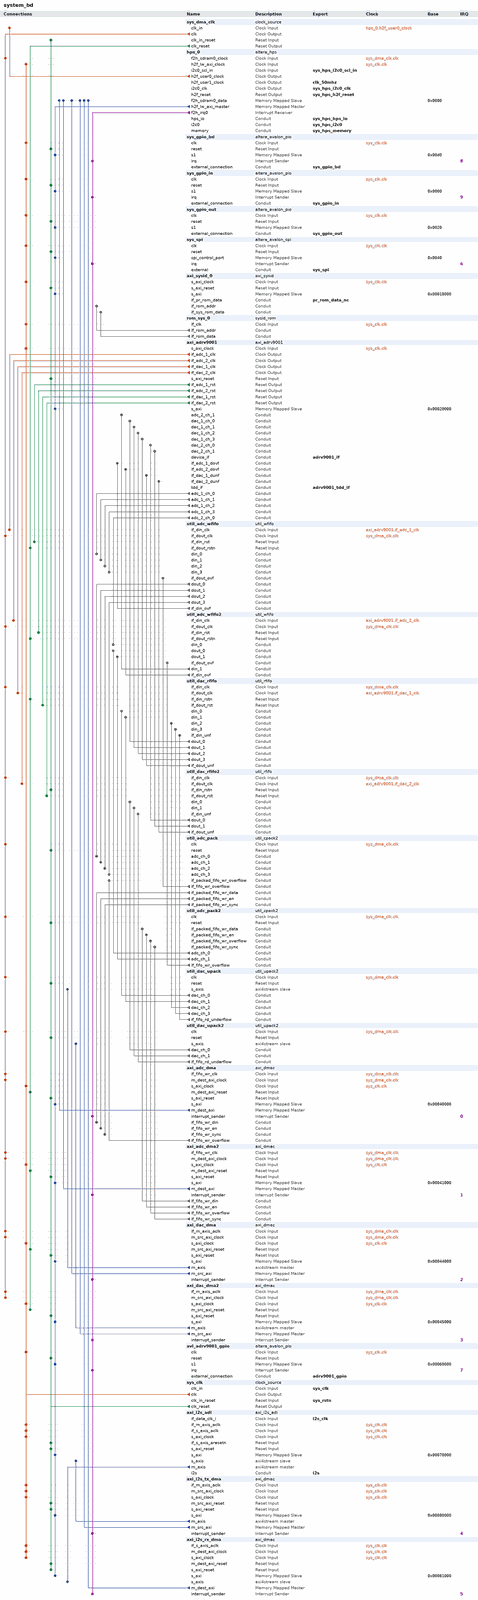
[diagram p0: system contents, whole]
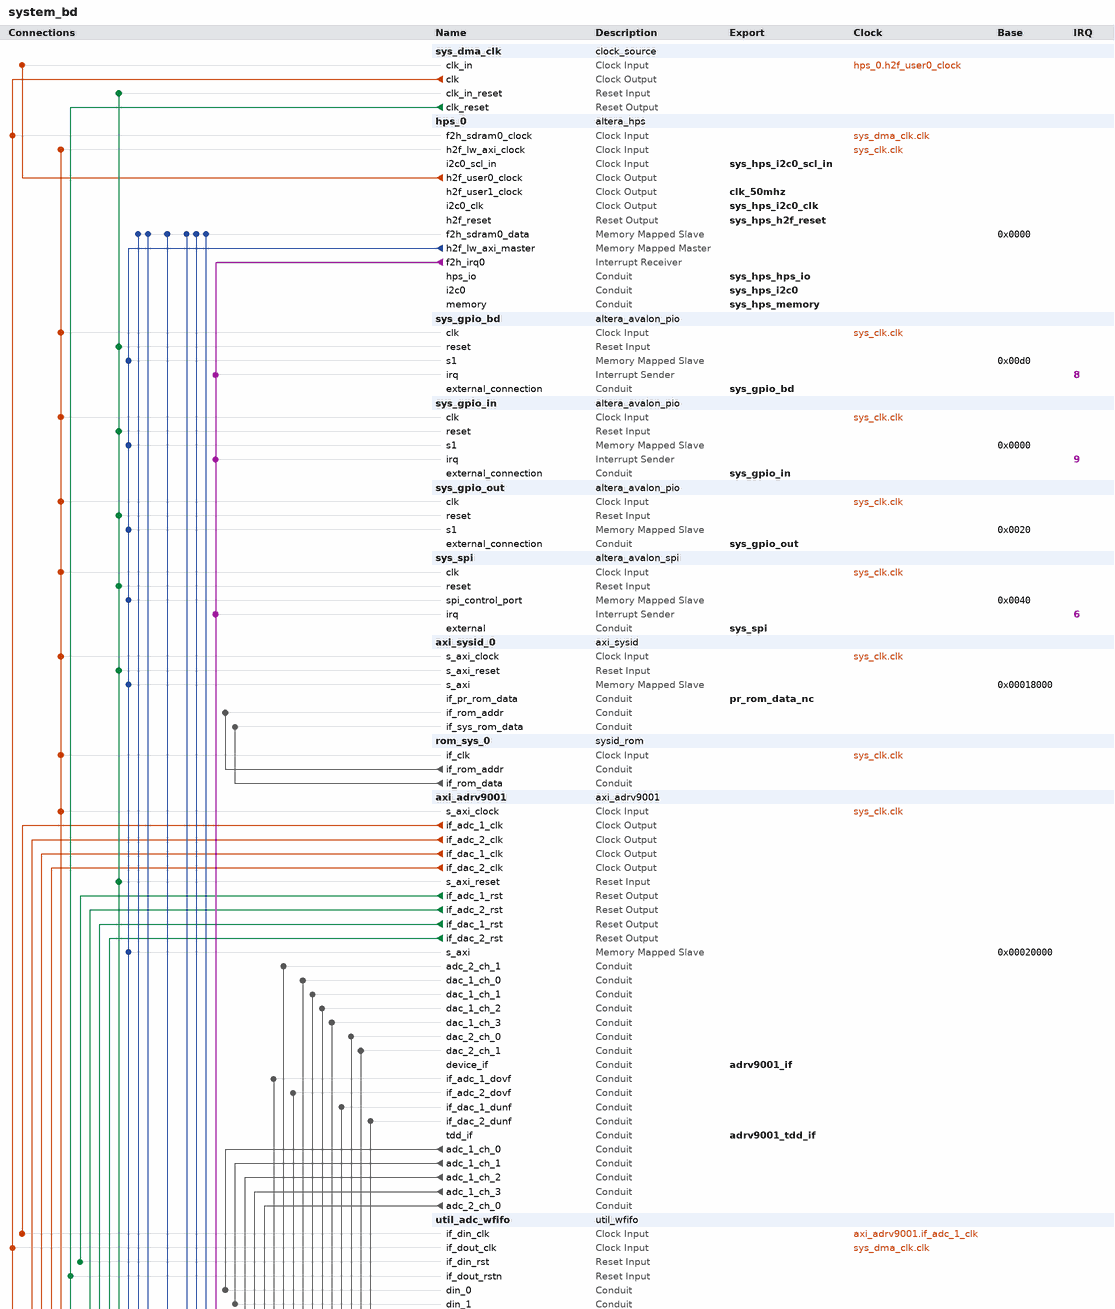
[diagram p1: system contents, upper part]
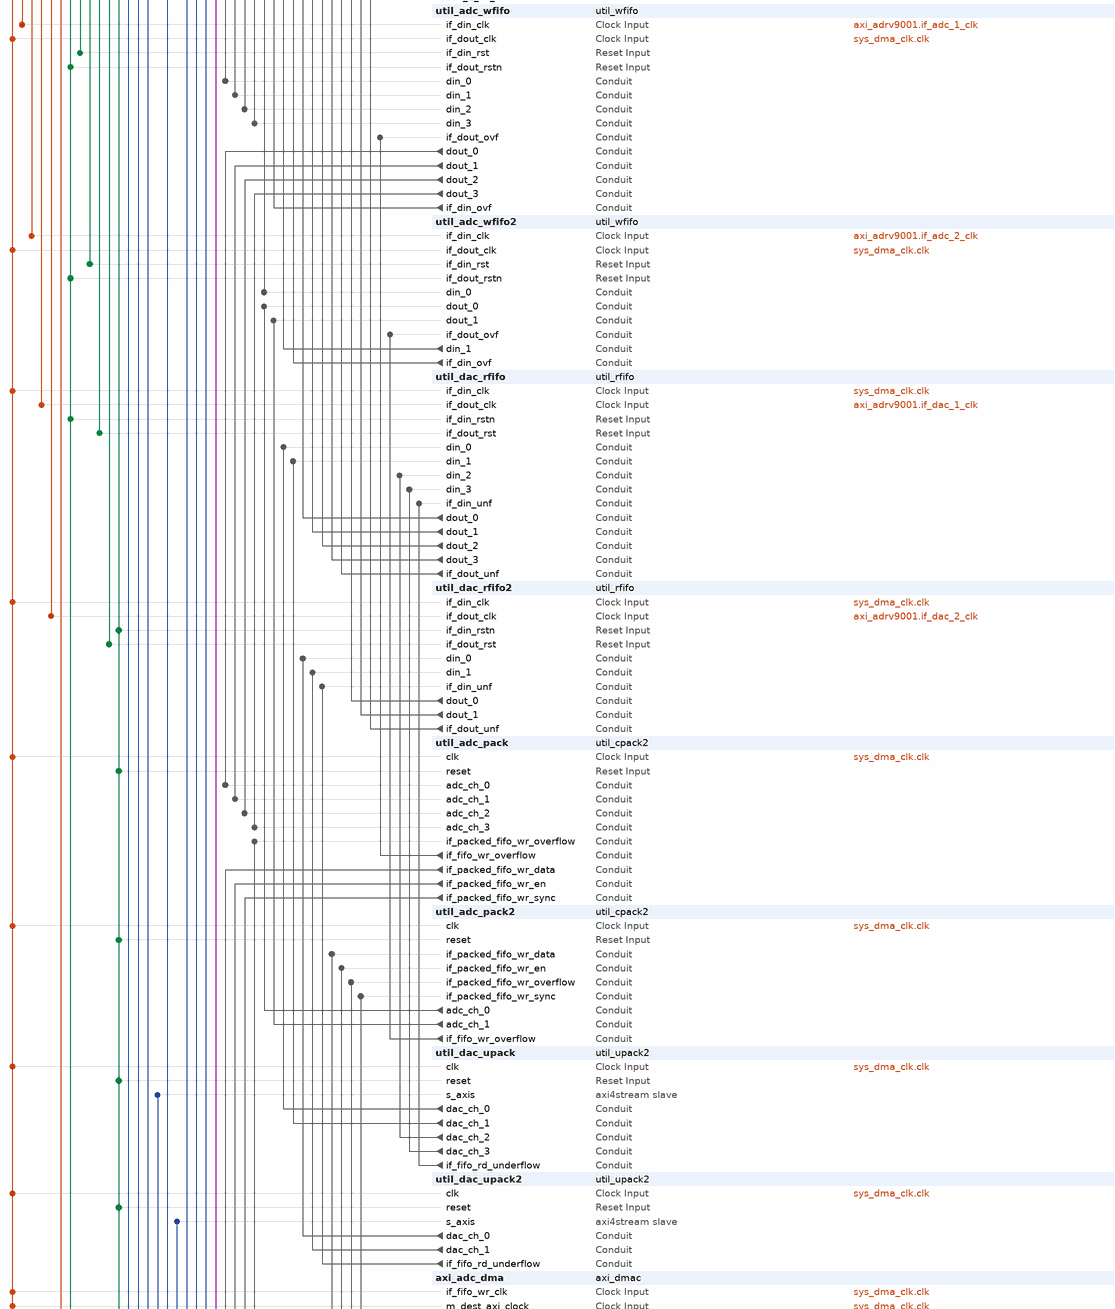
[diagram p2: system contents, middle part]
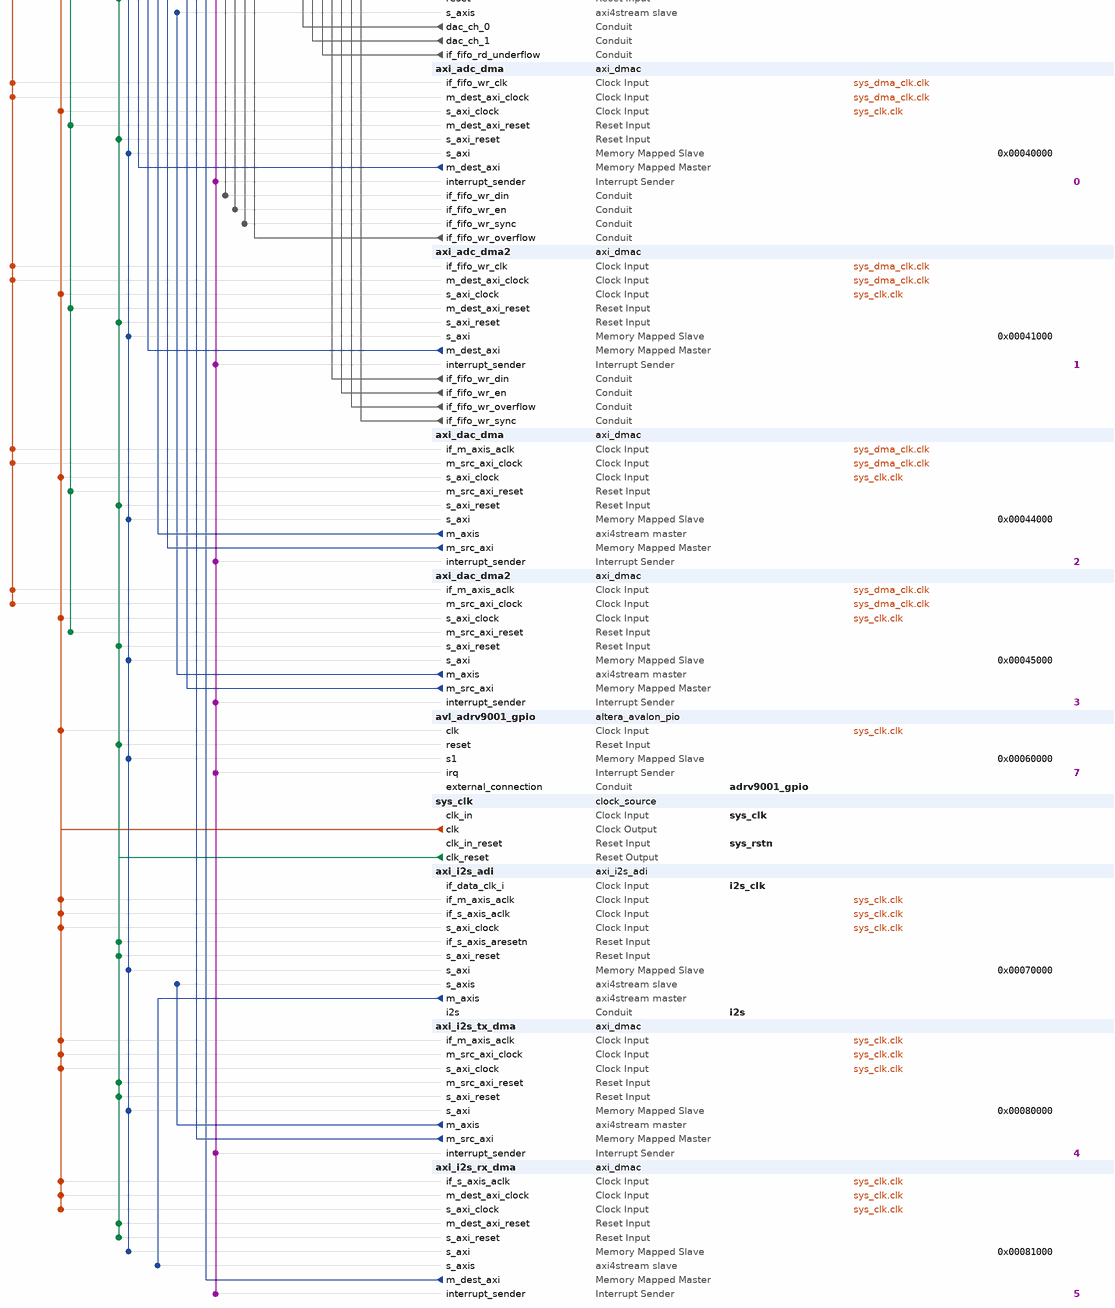
[diagram p3: system contents, lower part]
# Platform Designer (Qsys) system system_bd, Cyclone V 5CSEBA6U23C7
# Parameters at their usual value, and those the tool derives, are not listed.
package require -exact qsys 20.1
create_system system_bd
set_project_property DEVICE_FAMILY {Cyclone V}
set_project_property DEVICE 5CSEBA6U23C7

add_instance sys_dma_clk clock_source 20.1
set_instance_parameter_value sys_dma_clk clockFrequency 80000000

add_instance hps_0 altera_hps 20.1
set_instance_parameter_value hps_0 EMAC1_Mode N/A
set_instance_parameter_value hps_0 EMAC1_PinMuxing Unused
set_instance_parameter_value hps_0 F2SCLK_COLDRST_Enable false
set_instance_parameter_value hps_0 F2SCLK_DBGRST_Enable false
set_instance_parameter_value hps_0 F2SCLK_WARMRST_Enable false
set_instance_parameter_value hps_0 F2SDRAM_Type AXI-3
set_instance_parameter_value hps_0 F2SDRAM_Width 128
set_instance_parameter_value hps_0 F2SINTERRUPT_Enable true
set_instance_parameter_value hps_0 F2S_Width 0
set_instance_parameter_value hps_0 FPGA_PERIPHERAL_OUTPUT_CLOCK_FREQ_EMAC0_GTX_CLK 125
set_instance_parameter_value hps_0 FPGA_PERIPHERAL_OUTPUT_CLOCK_FREQ_EMAC0_MD_CLK 2.5
set_instance_parameter_value hps_0 FPGA_PERIPHERAL_OUTPUT_CLOCK_FREQ_EMAC1_GTX_CLK 125
set_instance_parameter_value hps_0 FPGA_PERIPHERAL_OUTPUT_CLOCK_FREQ_EMAC1_MD_CLK 2.5
set_instance_parameter_value hps_0 HPS_PROTOCOL DDR3
set_instance_parameter_value hps_0 I2C0_Mode Full
set_instance_parameter_value hps_0 I2C0_PinMuxing FPGA
set_instance_parameter_value hps_0 I2C1_Mode N/A
set_instance_parameter_value hps_0 I2C1_PinMuxing Unused
set_instance_parameter_value hps_0 LWH2F_Enable true
set_instance_parameter_value hps_0 MEM_BANKADDR_WIDTH 3
set_instance_parameter_value hps_0 MEM_CLK_FREQ 333.3
set_instance_parameter_value hps_0 MEM_COL_ADDR_WIDTH 10
set_instance_parameter_value hps_0 MEM_DQ_WIDTH 32
set_instance_parameter_value hps_0 MEM_DRV_STR RZQ/6
set_instance_parameter_value hps_0 MEM_ROW_ADDR_WIDTH 15
set_instance_parameter_value hps_0 MEM_RTT_NOM RZQ/4
set_instance_parameter_value hps_0 MEM_RTT_WR {Dynamic ODT off}
set_instance_parameter_value hps_0 MEM_TCL 7
set_instance_parameter_value hps_0 MEM_TFAW_NS 37.5
set_instance_parameter_value hps_0 MEM_TRAS_NS 35.0
set_instance_parameter_value hps_0 MEM_TRCD_NS 13.75
set_instance_parameter_value hps_0 MEM_TRFC_NS 300.0
set_instance_parameter_value hps_0 MEM_TRP_NS 13.75
set_instance_parameter_value hps_0 MEM_VENDOR Other
set_instance_parameter_value hps_0 MEM_WTCL 7
set_instance_parameter_value hps_0 QSPI_Mode {1 SS}
set_instance_parameter_value hps_0 QSPI_PinMuxing {HPS I/O Set 0}
set_instance_parameter_value hps_0 REF_CLK_FREQ 25.0
set_instance_parameter_value hps_0 S2FCLK_USER0CLK_Enable true
set_instance_parameter_value hps_0 S2FCLK_USER1CLK_Enable true
set_instance_parameter_value hps_0 S2FCLK_USER1CLK_FREQ 50.0
set_instance_parameter_value hps_0 S2FCLK_USER2CLK 3
set_instance_parameter_value hps_0 S2F_Width 0
set_instance_parameter_value hps_0 SDIO_Mode {4-bit Data}
set_instance_parameter_value hps_0 SDIO_PinMuxing {HPS I/O Set 0}
set_instance_parameter_value hps_0 SPIM1_Mode N/A
set_instance_parameter_value hps_0 SPIM1_PinMuxing Unused
set_instance_parameter_value hps_0 STM_Enable false
set_instance_parameter_value hps_0 TIMING_BOARD_AC_SKEW 0.02
set_instance_parameter_value hps_0 TIMING_BOARD_AC_TO_CK_SKEW 0.0
set_instance_parameter_value hps_0 TIMING_BOARD_DQ_TO_DQS_SKEW 0.0
set_instance_parameter_value hps_0 TIMING_BOARD_MAX_CK_DELAY 0.6
set_instance_parameter_value hps_0 TIMING_BOARD_MAX_DQS_DELAY 0.6
set_instance_parameter_value hps_0 TIMING_BOARD_SKEW_BETWEEN_DQS 0.02
set_instance_parameter_value hps_0 TIMING_BOARD_SKEW_CKDQS_DIMM_MAX 0.01
set_instance_parameter_value hps_0 TIMING_BOARD_SKEW_CKDQS_DIMM_MIN -0.01
set_instance_parameter_value hps_0 TIMING_BOARD_SKEW_WITHIN_DQS 0.02
set_instance_parameter_value hps_0 TIMING_TDH 125
set_instance_parameter_value hps_0 TIMING_TDQSCK 400
set_instance_parameter_value hps_0 TIMING_TDQSQ 120
set_instance_parameter_value hps_0 TIMING_TDS 50
set_instance_parameter_value hps_0 TIMING_TIH 250
set_instance_parameter_value hps_0 TIMING_TIS 175
set_instance_parameter_value hps_0 TIMING_TQSH 0.38
set_instance_parameter_value hps_0 UART0_Mode {No Flow Control}
set_instance_parameter_value hps_0 UART0_PinMuxing {HPS I/O Set 1}
set_instance_parameter_value hps_0 USB1_Mode SDR
set_instance_parameter_value hps_0 USB1_PinMuxing {HPS I/O Set 0}
set_instance_parameter_value hps_0 desired_cfg_clk_mhz 80.0
set_instance_parameter_value hps_0 desired_qspi_clk_mhz 400.0

add_instance sys_gpio_bd altera_avalon_pio 20.1
set_instance_parameter_value sys_gpio_bd direction InOut
set_instance_parameter_value sys_gpio_bd generateIRQ true
set_instance_parameter_value sys_gpio_bd width 32

add_instance sys_gpio_in altera_avalon_pio 20.1
set_instance_parameter_value sys_gpio_in direction Input
set_instance_parameter_value sys_gpio_in generateIRQ true
set_instance_parameter_value sys_gpio_in width 32

add_instance sys_gpio_out altera_avalon_pio 20.1
set_instance_parameter_value sys_gpio_out direction Output
set_instance_parameter_value sys_gpio_out width 32

add_instance sys_spi altera_avalon_spi 20.1
set_instance_parameter_value sys_spi clockPolarity 0
set_instance_parameter_value sys_spi dataWidth 8
set_instance_parameter_value sys_spi masterSPI true
set_instance_parameter_value sys_spi numberOfSlaves 1
set_instance_parameter_value sys_spi targetClockRate 10000000

add_instance axi_sysid_0 axi_sysid 1.0
set_instance_parameter_value axi_sysid_0 ROM_ADDR_BITS 9
set_instance_parameter_value axi_sysid_0 ROM_WIDTH 32

add_instance rom_sys_0 sysid_rom 1.0
set_instance_parameter_value rom_sys_0 PATH_TO_FILE mem_init_sys.txt
set_instance_parameter_value rom_sys_0 ROM_ADDR_BITS 9
set_instance_parameter_value rom_sys_0 ROM_WIDTH 32

add_instance axi_adrv9001 axi_adrv9001 1.0
set_instance_parameter_value axi_adrv9001 CMOS_LVDS_N 0
set_instance_parameter_value axi_adrv9001 DDS_DISABLE 0
set_instance_parameter_value axi_adrv9001 DEVICE 5CSEBA6U23C7
set_instance_parameter_value axi_adrv9001 DEV_PACKAGE_MANUAL 0
set_instance_parameter_value axi_adrv9001 FPGA_FAMILY_MANUAL 0
set_instance_parameter_value axi_adrv9001 FPGA_TECHNOLOGY_MANUAL 100
set_instance_parameter_value axi_adrv9001 ID 0
set_instance_parameter_value axi_adrv9001 IO_DELAY_GROUP dev_if_delay_group
set_instance_parameter_value axi_adrv9001 SPEED_GRADE_MANUAL 0

add_instance util_adc_wfifo util_wfifo 1.0
set_instance_parameter_value util_adc_wfifo DIN_ADDRESS_WIDTH 5
set_instance_parameter_value util_adc_wfifo DIN_DATA_WIDTH 16
set_instance_parameter_value util_adc_wfifo DOUT_DATA_WIDTH 16
set_instance_parameter_value util_adc_wfifo NUM_OF_CHANNELS 4

add_instance util_adc_wfifo2 util_wfifo 1.0
set_instance_parameter_value util_adc_wfifo2 DIN_ADDRESS_WIDTH 5
set_instance_parameter_value util_adc_wfifo2 DIN_DATA_WIDTH 16
set_instance_parameter_value util_adc_wfifo2 DOUT_DATA_WIDTH 16
set_instance_parameter_value util_adc_wfifo2 NUM_OF_CHANNELS 2

add_instance util_dac_rfifo util_rfifo 1.0
set_instance_parameter_value util_dac_rfifo DIN_ADDRESS_WIDTH 5
set_instance_parameter_value util_dac_rfifo DIN_DATA_WIDTH 16
set_instance_parameter_value util_dac_rfifo DOUT_DATA_WIDTH 16
set_instance_parameter_value util_dac_rfifo NUM_OF_CHANNELS 4

add_instance util_dac_rfifo2 util_rfifo 1.0
set_instance_parameter_value util_dac_rfifo2 DIN_ADDRESS_WIDTH 5
set_instance_parameter_value util_dac_rfifo2 DIN_DATA_WIDTH 16
set_instance_parameter_value util_dac_rfifo2 DOUT_DATA_WIDTH 16
set_instance_parameter_value util_dac_rfifo2 NUM_OF_CHANNELS 2

add_instance util_adc_pack util_cpack2 1.0
set_instance_parameter_value util_adc_pack NUM_OF_CHANNELS 4
set_instance_parameter_value util_adc_pack SAMPLES_PER_CHANNEL 1
set_instance_parameter_value util_adc_pack SAMPLE_DATA_WIDTH 16

add_instance util_adc_pack2 util_cpack2 1.0
set_instance_parameter_value util_adc_pack2 NUM_OF_CHANNELS 2
set_instance_parameter_value util_adc_pack2 SAMPLES_PER_CHANNEL 1
set_instance_parameter_value util_adc_pack2 SAMPLE_DATA_WIDTH 16

add_instance util_dac_upack util_upack2 1.0
set_instance_parameter_value util_dac_upack INTERFACE_TYPE 0
set_instance_parameter_value util_dac_upack NUM_OF_CHANNELS 4
set_instance_parameter_value util_dac_upack SAMPLES_PER_CHANNEL 1
set_instance_parameter_value util_dac_upack SAMPLE_DATA_WIDTH 16

add_instance util_dac_upack2 util_upack2 1.0
set_instance_parameter_value util_dac_upack2 INTERFACE_TYPE 0
set_instance_parameter_value util_dac_upack2 NUM_OF_CHANNELS 2
set_instance_parameter_value util_dac_upack2 SAMPLES_PER_CHANNEL 1
set_instance_parameter_value util_dac_upack2 SAMPLE_DATA_WIDTH 16

add_instance axi_adc_dma axi_dmac 1.0
set_instance_parameter_value axi_adc_dma ASYNC_CLK_DEST_REQ_MANUAL 1
set_instance_parameter_value axi_adc_dma ASYNC_CLK_REQ_SRC_MANUAL 1
set_instance_parameter_value axi_adc_dma ASYNC_CLK_SRC_DEST_MANUAL 1
set_instance_parameter_value axi_adc_dma AXI_SLICE_DEST 0
set_instance_parameter_value axi_adc_dma AXI_SLICE_SRC 0
set_instance_parameter_value axi_adc_dma CLK_DOMAIN_DEST_AXI 16
set_instance_parameter_value axi_adc_dma CLK_DOMAIN_DEST_FIFO 0
set_instance_parameter_value axi_adc_dma CLK_DOMAIN_DEST_SAXI 0
set_instance_parameter_value axi_adc_dma CLK_DOMAIN_REQ 3
set_instance_parameter_value axi_adc_dma CLK_DOMAIN_SRC_AXI 0
set_instance_parameter_value axi_adc_dma CLK_DOMAIN_SRC_FIFO 16
set_instance_parameter_value axi_adc_dma CLK_DOMAIN_SRC_SAXI 0
set_instance_parameter_value axi_adc_dma CYCLIC 0
set_instance_parameter_value axi_adc_dma DISABLE_DEBUG_REGISTERS 0
set_instance_parameter_value axi_adc_dma DMA_2D_TRANSFER 0
set_instance_parameter_value axi_adc_dma DMA_AXIS_DEST_W 4
set_instance_parameter_value axi_adc_dma DMA_AXIS_ID_W 8
set_instance_parameter_value axi_adc_dma DMA_AXI_ADDR_WIDTH 32
set_instance_parameter_value axi_adc_dma DMA_AXI_PROTOCOL_DEST 1
set_instance_parameter_value axi_adc_dma DMA_AXI_PROTOCOL_SRC 1
set_instance_parameter_value axi_adc_dma DMA_DATA_WIDTH_DEST 64
set_instance_parameter_value axi_adc_dma DMA_DATA_WIDTH_SRC 64
set_instance_parameter_value axi_adc_dma DMA_LENGTH_WIDTH 24
set_instance_parameter_value axi_adc_dma DMA_TYPE_DEST 0
set_instance_parameter_value axi_adc_dma DMA_TYPE_SRC 2
set_instance_parameter_value axi_adc_dma ENABLE_DIAGNOSTICS_IF 0
set_instance_parameter_value axi_adc_dma FIFO_SIZE 4
set_instance_parameter_value axi_adc_dma HAS_AXIS_TDEST 0
set_instance_parameter_value axi_adc_dma HAS_AXIS_TID 0
set_instance_parameter_value axi_adc_dma HAS_AXIS_TKEEP 0
set_instance_parameter_value axi_adc_dma HAS_AXIS_TLAST 0
set_instance_parameter_value axi_adc_dma HAS_AXIS_TSTRB 0
set_instance_parameter_value axi_adc_dma HAS_AXIS_TUSER 0
set_instance_parameter_value axi_adc_dma ID 0
set_instance_parameter_value axi_adc_dma MAX_BYTES_PER_BURST 128
set_instance_parameter_value axi_adc_dma SYNC_TRANSFER_START 1

add_instance axi_adc_dma2 axi_dmac 1.0
set_instance_parameter_value axi_adc_dma2 ASYNC_CLK_DEST_REQ_MANUAL 1
set_instance_parameter_value axi_adc_dma2 ASYNC_CLK_REQ_SRC_MANUAL 1
set_instance_parameter_value axi_adc_dma2 ASYNC_CLK_SRC_DEST_MANUAL 1
set_instance_parameter_value axi_adc_dma2 AXI_SLICE_DEST 0
set_instance_parameter_value axi_adc_dma2 AXI_SLICE_SRC 0
set_instance_parameter_value axi_adc_dma2 CLK_DOMAIN_DEST_AXI 16
set_instance_parameter_value axi_adc_dma2 CLK_DOMAIN_DEST_FIFO 0
set_instance_parameter_value axi_adc_dma2 CLK_DOMAIN_DEST_SAXI 0
set_instance_parameter_value axi_adc_dma2 CLK_DOMAIN_REQ 3
set_instance_parameter_value axi_adc_dma2 CLK_DOMAIN_SRC_AXI 0
set_instance_parameter_value axi_adc_dma2 CLK_DOMAIN_SRC_FIFO 16
set_instance_parameter_value axi_adc_dma2 CLK_DOMAIN_SRC_SAXI 0
set_instance_parameter_value axi_adc_dma2 CYCLIC 0
set_instance_parameter_value axi_adc_dma2 DISABLE_DEBUG_REGISTERS 0
set_instance_parameter_value axi_adc_dma2 DMA_2D_TRANSFER 0
set_instance_parameter_value axi_adc_dma2 DMA_AXIS_DEST_W 4
set_instance_parameter_value axi_adc_dma2 DMA_AXIS_ID_W 8
set_instance_parameter_value axi_adc_dma2 DMA_AXI_ADDR_WIDTH 32
set_instance_parameter_value axi_adc_dma2 DMA_AXI_PROTOCOL_DEST 1
set_instance_parameter_value axi_adc_dma2 DMA_AXI_PROTOCOL_SRC 1
set_instance_parameter_value axi_adc_dma2 DMA_DATA_WIDTH_DEST 64
set_instance_parameter_value axi_adc_dma2 DMA_DATA_WIDTH_SRC 32
set_instance_parameter_value axi_adc_dma2 DMA_LENGTH_WIDTH 24
set_instance_parameter_value axi_adc_dma2 DMA_TYPE_DEST 0
set_instance_parameter_value axi_adc_dma2 DMA_TYPE_SRC 2
set_instance_parameter_value axi_adc_dma2 ENABLE_DIAGNOSTICS_IF 0
set_instance_parameter_value axi_adc_dma2 FIFO_SIZE 2
set_instance_parameter_value axi_adc_dma2 HAS_AXIS_TDEST 0
set_instance_parameter_value axi_adc_dma2 HAS_AXIS_TID 0
set_instance_parameter_value axi_adc_dma2 HAS_AXIS_TKEEP 0
set_instance_parameter_value axi_adc_dma2 HAS_AXIS_TLAST 0
set_instance_parameter_value axi_adc_dma2 HAS_AXIS_TSTRB 0
set_instance_parameter_value axi_adc_dma2 HAS_AXIS_TUSER 0
set_instance_parameter_value axi_adc_dma2 ID 1
set_instance_parameter_value axi_adc_dma2 MAX_BYTES_PER_BURST 64
set_instance_parameter_value axi_adc_dma2 SYNC_TRANSFER_START 1

add_instance axi_dac_dma axi_dmac 1.0
set_instance_parameter_value axi_dac_dma ASYNC_CLK_DEST_REQ_MANUAL 1
set_instance_parameter_value axi_dac_dma ASYNC_CLK_REQ_SRC_MANUAL 1
set_instance_parameter_value axi_dac_dma ASYNC_CLK_SRC_DEST_MANUAL 1
set_instance_parameter_value axi_dac_dma AXI_SLICE_DEST 0
set_instance_parameter_value axi_dac_dma AXI_SLICE_SRC 0
set_instance_parameter_value axi_dac_dma CLK_DOMAIN_DEST_AXI 0
set_instance_parameter_value axi_dac_dma CLK_DOMAIN_DEST_FIFO 0
set_instance_parameter_value axi_dac_dma CLK_DOMAIN_DEST_SAXI 16
set_instance_parameter_value axi_dac_dma CLK_DOMAIN_REQ 3
set_instance_parameter_value axi_dac_dma CLK_DOMAIN_SRC_AXI 16
set_instance_parameter_value axi_dac_dma CLK_DOMAIN_SRC_FIFO 0
set_instance_parameter_value axi_dac_dma CLK_DOMAIN_SRC_SAXI 0
set_instance_parameter_value axi_dac_dma CYCLIC 1
set_instance_parameter_value axi_dac_dma DISABLE_DEBUG_REGISTERS 0
set_instance_parameter_value axi_dac_dma DMA_2D_TRANSFER 0
set_instance_parameter_value axi_dac_dma DMA_AXIS_DEST_W 4
set_instance_parameter_value axi_dac_dma DMA_AXIS_ID_W 8
set_instance_parameter_value axi_dac_dma DMA_AXI_ADDR_WIDTH 32
set_instance_parameter_value axi_dac_dma DMA_AXI_PROTOCOL_DEST 1
set_instance_parameter_value axi_dac_dma DMA_AXI_PROTOCOL_SRC 1
set_instance_parameter_value axi_dac_dma DMA_DATA_WIDTH_DEST 64
set_instance_parameter_value axi_dac_dma DMA_DATA_WIDTH_SRC 64
set_instance_parameter_value axi_dac_dma DMA_LENGTH_WIDTH 24
set_instance_parameter_value axi_dac_dma DMA_TYPE_DEST 1
set_instance_parameter_value axi_dac_dma DMA_TYPE_SRC 0
set_instance_parameter_value axi_dac_dma ENABLE_DIAGNOSTICS_IF 0
set_instance_parameter_value axi_dac_dma FIFO_SIZE 4
set_instance_parameter_value axi_dac_dma HAS_AXIS_TDEST 0
set_instance_parameter_value axi_dac_dma HAS_AXIS_TID 0
set_instance_parameter_value axi_dac_dma HAS_AXIS_TKEEP 0
set_instance_parameter_value axi_dac_dma HAS_AXIS_TLAST 0
set_instance_parameter_value axi_dac_dma HAS_AXIS_TSTRB 0
set_instance_parameter_value axi_dac_dma HAS_AXIS_TUSER 0
set_instance_parameter_value axi_dac_dma ID 0
set_instance_parameter_value axi_dac_dma MAX_BYTES_PER_BURST 128
set_instance_parameter_value axi_dac_dma SYNC_TRANSFER_START 0

add_instance axi_dac_dma2 axi_dmac 1.0
set_instance_parameter_value axi_dac_dma2 ASYNC_CLK_DEST_REQ_MANUAL 1
set_instance_parameter_value axi_dac_dma2 ASYNC_CLK_REQ_SRC_MANUAL 1
set_instance_parameter_value axi_dac_dma2 ASYNC_CLK_SRC_DEST_MANUAL 1
set_instance_parameter_value axi_dac_dma2 AXI_SLICE_DEST 0
set_instance_parameter_value axi_dac_dma2 AXI_SLICE_SRC 0
set_instance_parameter_value axi_dac_dma2 CLK_DOMAIN_DEST_AXI 0
set_instance_parameter_value axi_dac_dma2 CLK_DOMAIN_DEST_FIFO 0
set_instance_parameter_value axi_dac_dma2 CLK_DOMAIN_DEST_SAXI 16
set_instance_parameter_value axi_dac_dma2 CLK_DOMAIN_REQ 3
set_instance_parameter_value axi_dac_dma2 CLK_DOMAIN_SRC_AXI 16
set_instance_parameter_value axi_dac_dma2 CLK_DOMAIN_SRC_FIFO 0
set_instance_parameter_value axi_dac_dma2 CLK_DOMAIN_SRC_SAXI 0
set_instance_parameter_value axi_dac_dma2 CYCLIC 1
set_instance_parameter_value axi_dac_dma2 DISABLE_DEBUG_REGISTERS 0
set_instance_parameter_value axi_dac_dma2 DMA_2D_TRANSFER 0
set_instance_parameter_value axi_dac_dma2 DMA_AXIS_DEST_W 4
set_instance_parameter_value axi_dac_dma2 DMA_AXIS_ID_W 8
set_instance_parameter_value axi_dac_dma2 DMA_AXI_ADDR_WIDTH 32
set_instance_parameter_value axi_dac_dma2 DMA_AXI_PROTOCOL_DEST 1
set_instance_parameter_value axi_dac_dma2 DMA_AXI_PROTOCOL_SRC 1
set_instance_parameter_value axi_dac_dma2 DMA_DATA_WIDTH_DEST 32
set_instance_parameter_value axi_dac_dma2 DMA_DATA_WIDTH_SRC 64
set_instance_parameter_value axi_dac_dma2 DMA_LENGTH_WIDTH 24
set_instance_parameter_value axi_dac_dma2 DMA_TYPE_DEST 1
set_instance_parameter_value axi_dac_dma2 DMA_TYPE_SRC 0
set_instance_parameter_value axi_dac_dma2 ENABLE_DIAGNOSTICS_IF 0
set_instance_parameter_value axi_dac_dma2 FIFO_SIZE 2
set_instance_parameter_value axi_dac_dma2 HAS_AXIS_TDEST 0
set_instance_parameter_value axi_dac_dma2 HAS_AXIS_TID 0
set_instance_parameter_value axi_dac_dma2 HAS_AXIS_TKEEP 0
set_instance_parameter_value axi_dac_dma2 HAS_AXIS_TLAST 0
set_instance_parameter_value axi_dac_dma2 HAS_AXIS_TSTRB 0
set_instance_parameter_value axi_dac_dma2 HAS_AXIS_TUSER 0
set_instance_parameter_value axi_dac_dma2 ID 1
set_instance_parameter_value axi_dac_dma2 MAX_BYTES_PER_BURST 64
set_instance_parameter_value axi_dac_dma2 SYNC_TRANSFER_START 0

add_instance avl_adrv9001_gpio altera_avalon_pio 20.1
set_instance_parameter_value avl_adrv9001_gpio direction Bidir
set_instance_parameter_value avl_adrv9001_gpio generateIRQ true
set_instance_parameter_value avl_adrv9001_gpio width 19

add_instance sys_clk clock_source 20.1
set_instance_parameter_value sys_clk clockFrequency 50000000

add_instance axi_i2s_adi axi_i2s_adi 1.0
set_instance_parameter_value axi_i2s_adi BCLK_POL 0
set_instance_parameter_value axi_i2s_adi DMA_TYPE 0
set_instance_parameter_value axi_i2s_adi HAS_RX 1
set_instance_parameter_value axi_i2s_adi HAS_TX 1
set_instance_parameter_value axi_i2s_adi LRCLK_POL 0
set_instance_parameter_value axi_i2s_adi NUM_OF_CHANNEL 1
set_instance_parameter_value axi_i2s_adi SLOT_WIDTH 24
set_instance_parameter_value axi_i2s_adi S_AXI_ADDRESS_WIDTH 16
set_instance_parameter_value axi_i2s_adi S_AXI_DATA_WIDTH 32

add_instance axi_i2s_tx_dma axi_dmac 1.0
set_instance_parameter_value axi_i2s_tx_dma ASYNC_CLK_DEST_REQ_MANUAL 1
set_instance_parameter_value axi_i2s_tx_dma ASYNC_CLK_REQ_SRC_MANUAL 1
set_instance_parameter_value axi_i2s_tx_dma ASYNC_CLK_SRC_DEST_MANUAL 1
set_instance_parameter_value axi_i2s_tx_dma AXI_SLICE_DEST 0
set_instance_parameter_value axi_i2s_tx_dma AXI_SLICE_SRC 0
set_instance_parameter_value axi_i2s_tx_dma CLK_DOMAIN_DEST_AXI 0
set_instance_parameter_value axi_i2s_tx_dma CLK_DOMAIN_DEST_FIFO 0
set_instance_parameter_value axi_i2s_tx_dma CLK_DOMAIN_DEST_SAXI 3
set_instance_parameter_value axi_i2s_tx_dma CLK_DOMAIN_REQ 3
set_instance_parameter_value axi_i2s_tx_dma CLK_DOMAIN_SRC_AXI 3
set_instance_parameter_value axi_i2s_tx_dma CLK_DOMAIN_SRC_FIFO 0
set_instance_parameter_value axi_i2s_tx_dma CLK_DOMAIN_SRC_SAXI 0
set_instance_parameter_value axi_i2s_tx_dma CYCLIC 1
set_instance_parameter_value axi_i2s_tx_dma DISABLE_DEBUG_REGISTERS 0
set_instance_parameter_value axi_i2s_tx_dma DMA_2D_TRANSFER 0
set_instance_parameter_value axi_i2s_tx_dma DMA_AXIS_DEST_W 4
set_instance_parameter_value axi_i2s_tx_dma DMA_AXIS_ID_W 8
set_instance_parameter_value axi_i2s_tx_dma DMA_AXI_ADDR_WIDTH 32
set_instance_parameter_value axi_i2s_tx_dma DMA_AXI_PROTOCOL_DEST 1
set_instance_parameter_value axi_i2s_tx_dma DMA_AXI_PROTOCOL_SRC 1
set_instance_parameter_value axi_i2s_tx_dma DMA_DATA_WIDTH_DEST 32
set_instance_parameter_value axi_i2s_tx_dma DMA_DATA_WIDTH_SRC 64
set_instance_parameter_value axi_i2s_tx_dma DMA_LENGTH_WIDTH 24
set_instance_parameter_value axi_i2s_tx_dma DMA_TYPE_DEST 1
set_instance_parameter_value axi_i2s_tx_dma DMA_TYPE_SRC 0
set_instance_parameter_value axi_i2s_tx_dma ENABLE_DIAGNOSTICS_IF 0
set_instance_parameter_value axi_i2s_tx_dma FIFO_SIZE 8
set_instance_parameter_value axi_i2s_tx_dma HAS_AXIS_TDEST 0
set_instance_parameter_value axi_i2s_tx_dma HAS_AXIS_TID 0
set_instance_parameter_value axi_i2s_tx_dma HAS_AXIS_TKEEP 0
set_instance_parameter_value axi_i2s_tx_dma HAS_AXIS_TLAST 0
set_instance_parameter_value axi_i2s_tx_dma HAS_AXIS_TSTRB 0
set_instance_parameter_value axi_i2s_tx_dma HAS_AXIS_TUSER 0
set_instance_parameter_value axi_i2s_tx_dma ID 0
set_instance_parameter_value axi_i2s_tx_dma MAX_BYTES_PER_BURST 128
set_instance_parameter_value axi_i2s_tx_dma SYNC_TRANSFER_START 0

add_instance axi_i2s_rx_dma axi_dmac 1.0
set_instance_parameter_value axi_i2s_rx_dma ASYNC_CLK_DEST_REQ_MANUAL 1
set_instance_parameter_value axi_i2s_rx_dma ASYNC_CLK_REQ_SRC_MANUAL 1
set_instance_parameter_value axi_i2s_rx_dma ASYNC_CLK_SRC_DEST_MANUAL 1
set_instance_parameter_value axi_i2s_rx_dma AXI_SLICE_DEST 0
set_instance_parameter_value axi_i2s_rx_dma AXI_SLICE_SRC 0
set_instance_parameter_value axi_i2s_rx_dma CLK_DOMAIN_DEST_AXI 3
set_instance_parameter_value axi_i2s_rx_dma CLK_DOMAIN_DEST_FIFO 0
set_instance_parameter_value axi_i2s_rx_dma CLK_DOMAIN_DEST_SAXI 0
set_instance_parameter_value axi_i2s_rx_dma CLK_DOMAIN_REQ 3
set_instance_parameter_value axi_i2s_rx_dma CLK_DOMAIN_SRC_AXI 0
set_instance_parameter_value axi_i2s_rx_dma CLK_DOMAIN_SRC_FIFO 0
set_instance_parameter_value axi_i2s_rx_dma CLK_DOMAIN_SRC_SAXI 3
set_instance_parameter_value axi_i2s_rx_dma CYCLIC 0
set_instance_parameter_value axi_i2s_rx_dma DISABLE_DEBUG_REGISTERS 0
set_instance_parameter_value axi_i2s_rx_dma DMA_2D_TRANSFER 0
set_instance_parameter_value axi_i2s_rx_dma DMA_AXIS_DEST_W 4
set_instance_parameter_value axi_i2s_rx_dma DMA_AXIS_ID_W 8
set_instance_parameter_value axi_i2s_rx_dma DMA_AXI_ADDR_WIDTH 32
set_instance_parameter_value axi_i2s_rx_dma DMA_AXI_PROTOCOL_DEST 1
set_instance_parameter_value axi_i2s_rx_dma DMA_AXI_PROTOCOL_SRC 1
set_instance_parameter_value axi_i2s_rx_dma DMA_DATA_WIDTH_DEST 64
set_instance_parameter_value axi_i2s_rx_dma DMA_DATA_WIDTH_SRC 32
set_instance_parameter_value axi_i2s_rx_dma DMA_LENGTH_WIDTH 24
set_instance_parameter_value axi_i2s_rx_dma DMA_TYPE_DEST 0
set_instance_parameter_value axi_i2s_rx_dma DMA_TYPE_SRC 1
set_instance_parameter_value axi_i2s_rx_dma ENABLE_DIAGNOSTICS_IF 0
set_instance_parameter_value axi_i2s_rx_dma FIFO_SIZE 8
set_instance_parameter_value axi_i2s_rx_dma HAS_AXIS_TDEST 0
set_instance_parameter_value axi_i2s_rx_dma HAS_AXIS_TID 0
set_instance_parameter_value axi_i2s_rx_dma HAS_AXIS_TKEEP 0
set_instance_parameter_value axi_i2s_rx_dma HAS_AXIS_TLAST 0
set_instance_parameter_value axi_i2s_rx_dma HAS_AXIS_TSTRB 0
set_instance_parameter_value axi_i2s_rx_dma HAS_AXIS_TUSER 0
set_instance_parameter_value axi_i2s_rx_dma ID 0
set_instance_parameter_value axi_i2s_rx_dma MAX_BYTES_PER_BURST 128
set_instance_parameter_value axi_i2s_rx_dma SYNC_TRANSFER_START 0

# connections
add_connection axi_adrv9001.if_adc_1_clk util_adc_wfifo.if_din_clk clock
add_connection axi_adrv9001.if_adc_2_clk util_adc_wfifo2.if_din_clk clock
add_connection axi_adrv9001.if_dac_1_clk util_dac_rfifo.if_dout_clk clock
add_connection axi_adrv9001.if_dac_2_clk util_dac_rfifo2.if_dout_clk clock
add_connection hps_0.h2f_user0_clock sys_dma_clk.clk_in clock
add_connection sys_clk.clk avl_adrv9001_gpio.clk clock
add_connection sys_clk.clk axi_adc_dma2.s_axi_clock clock
add_connection sys_clk.clk axi_adc_dma.s_axi_clock clock
add_connection sys_clk.clk axi_adrv9001.s_axi_clock clock
add_connection sys_clk.clk axi_dac_dma2.s_axi_clock clock
add_connection sys_clk.clk axi_dac_dma.s_axi_clock clock
add_connection sys_clk.clk axi_i2s_adi.if_m_axis_aclk clock
add_connection sys_clk.clk axi_i2s_adi.if_s_axis_aclk clock
add_connection sys_clk.clk axi_i2s_adi.s_axi_clock clock
add_connection sys_clk.clk axi_i2s_rx_dma.if_s_axis_aclk clock
add_connection sys_clk.clk axi_i2s_rx_dma.m_dest_axi_clock clock
add_connection sys_clk.clk axi_i2s_rx_dma.s_axi_clock clock
add_connection sys_clk.clk axi_i2s_tx_dma.if_m_axis_aclk clock
add_connection sys_clk.clk axi_i2s_tx_dma.m_src_axi_clock clock
add_connection sys_clk.clk axi_i2s_tx_dma.s_axi_clock clock
add_connection sys_clk.clk axi_sysid_0.s_axi_clock clock
add_connection sys_clk.clk hps_0.h2f_lw_axi_clock clock
add_connection sys_clk.clk rom_sys_0.if_clk clock
add_connection sys_clk.clk sys_gpio_bd.clk clock
add_connection sys_clk.clk sys_gpio_in.clk clock
add_connection sys_clk.clk sys_gpio_out.clk clock
add_connection sys_clk.clk sys_spi.clk clock
add_connection sys_dma_clk.clk axi_adc_dma2.if_fifo_wr_clk clock
add_connection sys_dma_clk.clk axi_adc_dma2.m_dest_axi_clock clock
add_connection sys_dma_clk.clk axi_adc_dma.if_fifo_wr_clk clock
add_connection sys_dma_clk.clk axi_adc_dma.m_dest_axi_clock clock
add_connection sys_dma_clk.clk axi_dac_dma2.if_m_axis_aclk clock
add_connection sys_dma_clk.clk axi_dac_dma2.m_src_axi_clock clock
add_connection sys_dma_clk.clk axi_dac_dma.if_m_axis_aclk clock
add_connection sys_dma_clk.clk axi_dac_dma.m_src_axi_clock clock
add_connection sys_dma_clk.clk hps_0.f2h_sdram0_clock clock
add_connection sys_dma_clk.clk util_adc_pack2.clk clock
add_connection sys_dma_clk.clk util_adc_pack.clk clock
add_connection sys_dma_clk.clk util_adc_wfifo2.if_dout_clk clock
add_connection sys_dma_clk.clk util_adc_wfifo.if_dout_clk clock
add_connection sys_dma_clk.clk util_dac_rfifo2.if_din_clk clock
add_connection sys_dma_clk.clk util_dac_rfifo.if_din_clk clock
add_connection sys_dma_clk.clk util_dac_upack2.clk clock
add_connection sys_dma_clk.clk util_dac_upack.clk clock
add_connection axi_adrv9001.if_adc_1_rst util_adc_wfifo.if_din_rst reset
add_connection axi_adrv9001.if_adc_2_rst util_adc_wfifo2.if_din_rst reset
add_connection axi_adrv9001.if_dac_1_rst util_dac_rfifo.if_dout_rst reset
add_connection axi_adrv9001.if_dac_2_rst util_dac_rfifo2.if_dout_rst reset
add_connection sys_clk.clk_reset avl_adrv9001_gpio.reset reset
add_connection sys_clk.clk_reset axi_adc_dma2.s_axi_reset reset
add_connection sys_clk.clk_reset axi_adc_dma.s_axi_reset reset
add_connection sys_clk.clk_reset axi_adrv9001.s_axi_reset reset
add_connection sys_clk.clk_reset axi_dac_dma2.s_axi_reset reset
add_connection sys_clk.clk_reset axi_dac_dma.s_axi_reset reset
add_connection sys_clk.clk_reset axi_i2s_adi.if_s_axis_aresetn reset
add_connection sys_clk.clk_reset axi_i2s_adi.s_axi_reset reset
add_connection sys_clk.clk_reset axi_i2s_rx_dma.m_dest_axi_reset reset
add_connection sys_clk.clk_reset axi_i2s_rx_dma.s_axi_reset reset
add_connection sys_clk.clk_reset axi_i2s_tx_dma.m_src_axi_reset reset
add_connection sys_clk.clk_reset axi_i2s_tx_dma.s_axi_reset reset
add_connection sys_clk.clk_reset axi_sysid_0.s_axi_reset reset
add_connection sys_clk.clk_reset sys_dma_clk.clk_in_reset reset
add_connection sys_clk.clk_reset sys_gpio_bd.reset reset
add_connection sys_clk.clk_reset sys_gpio_in.reset reset
add_connection sys_clk.clk_reset sys_gpio_out.reset reset
add_connection sys_clk.clk_reset sys_spi.reset reset
add_connection sys_clk.clk_reset util_adc_pack2.reset reset
add_connection sys_clk.clk_reset util_adc_pack.reset reset
add_connection sys_clk.clk_reset util_dac_rfifo2.if_din_rstn reset
add_connection sys_clk.clk_reset util_dac_upack2.reset reset
add_connection sys_clk.clk_reset util_dac_upack.reset reset
add_connection sys_dma_clk.clk_reset axi_adc_dma2.m_dest_axi_reset reset
add_connection sys_dma_clk.clk_reset axi_adc_dma.m_dest_axi_reset reset
add_connection sys_dma_clk.clk_reset axi_dac_dma2.m_src_axi_reset reset
add_connection sys_dma_clk.clk_reset axi_dac_dma.m_src_axi_reset reset
add_connection sys_dma_clk.clk_reset util_adc_wfifo2.if_dout_rstn reset
add_connection sys_dma_clk.clk_reset util_adc_wfifo.if_dout_rstn reset
add_connection sys_dma_clk.clk_reset util_dac_rfifo.if_din_rstn reset
add_connection axi_adc_dma2.m_dest_axi hps_0.f2h_sdram0_data avalon
set_connection_parameter_value axi_adc_dma2.m_dest_axi/hps_0.f2h_sdram0_data baseAddress 0x0000
add_connection axi_adc_dma.m_dest_axi hps_0.f2h_sdram0_data avalon
set_connection_parameter_value axi_adc_dma.m_dest_axi/hps_0.f2h_sdram0_data baseAddress 0x0000
add_connection axi_dac_dma2.m_src_axi hps_0.f2h_sdram0_data avalon
set_connection_parameter_value axi_dac_dma2.m_src_axi/hps_0.f2h_sdram0_data baseAddress 0x0000
add_connection axi_dac_dma.m_src_axi hps_0.f2h_sdram0_data avalon
set_connection_parameter_value axi_dac_dma.m_src_axi/hps_0.f2h_sdram0_data baseAddress 0x0000
add_connection axi_i2s_rx_dma.m_dest_axi hps_0.f2h_sdram0_data avalon
set_connection_parameter_value axi_i2s_rx_dma.m_dest_axi/hps_0.f2h_sdram0_data baseAddress 0x0000
add_connection axi_i2s_tx_dma.m_src_axi hps_0.f2h_sdram0_data avalon
set_connection_parameter_value axi_i2s_tx_dma.m_src_axi/hps_0.f2h_sdram0_data baseAddress 0x0000
add_connection hps_0.h2f_lw_axi_master avl_adrv9001_gpio.s1 avalon
set_connection_parameter_value hps_0.h2f_lw_axi_master/avl_adrv9001_gpio.s1 baseAddress 0x00060000
add_connection hps_0.h2f_lw_axi_master axi_adc_dma2.s_axi avalon
set_connection_parameter_value hps_0.h2f_lw_axi_master/axi_adc_dma2.s_axi baseAddress 0x00041000
add_connection hps_0.h2f_lw_axi_master axi_adc_dma.s_axi avalon
set_connection_parameter_value hps_0.h2f_lw_axi_master/axi_adc_dma.s_axi baseAddress 0x00040000
add_connection hps_0.h2f_lw_axi_master axi_adrv9001.s_axi avalon
set_connection_parameter_value hps_0.h2f_lw_axi_master/axi_adrv9001.s_axi baseAddress 0x00020000
add_connection hps_0.h2f_lw_axi_master axi_dac_dma2.s_axi avalon
set_connection_parameter_value hps_0.h2f_lw_axi_master/axi_dac_dma2.s_axi baseAddress 0x00045000
add_connection hps_0.h2f_lw_axi_master axi_dac_dma.s_axi avalon
set_connection_parameter_value hps_0.h2f_lw_axi_master/axi_dac_dma.s_axi baseAddress 0x00044000
add_connection hps_0.h2f_lw_axi_master axi_i2s_adi.s_axi avalon
set_connection_parameter_value hps_0.h2f_lw_axi_master/axi_i2s_adi.s_axi baseAddress 0x00070000
add_connection hps_0.h2f_lw_axi_master axi_i2s_rx_dma.s_axi avalon
set_connection_parameter_value hps_0.h2f_lw_axi_master/axi_i2s_rx_dma.s_axi baseAddress 0x00081000
add_connection hps_0.h2f_lw_axi_master axi_i2s_tx_dma.s_axi avalon
set_connection_parameter_value hps_0.h2f_lw_axi_master/axi_i2s_tx_dma.s_axi baseAddress 0x00080000
add_connection hps_0.h2f_lw_axi_master axi_sysid_0.s_axi avalon
set_connection_parameter_value hps_0.h2f_lw_axi_master/axi_sysid_0.s_axi baseAddress 0x00018000
add_connection hps_0.h2f_lw_axi_master sys_gpio_bd.s1 avalon
set_connection_parameter_value hps_0.h2f_lw_axi_master/sys_gpio_bd.s1 baseAddress 0x00d0
add_connection hps_0.h2f_lw_axi_master sys_gpio_in.s1 avalon
set_connection_parameter_value hps_0.h2f_lw_axi_master/sys_gpio_in.s1 baseAddress 0x0000
add_connection hps_0.h2f_lw_axi_master sys_gpio_out.s1 avalon
set_connection_parameter_value hps_0.h2f_lw_axi_master/sys_gpio_out.s1 baseAddress 0x0020
add_connection hps_0.h2f_lw_axi_master sys_spi.spi_control_port avalon
set_connection_parameter_value hps_0.h2f_lw_axi_master/sys_spi.spi_control_port baseAddress 0x0040
add_connection axi_dac_dma2.m_axis util_dac_upack2.s_axis axi4stream
add_connection axi_dac_dma.m_axis util_dac_upack.s_axis axi4stream
add_connection axi_i2s_adi.m_axis axi_i2s_rx_dma.s_axis axi4stream
add_connection axi_i2s_tx_dma.m_axis axi_i2s_adi.s_axis axi4stream
add_connection axi_adc_dma2.if_fifo_wr_din util_adc_pack2.if_packed_fifo_wr_data conduit
add_connection axi_adc_dma2.if_fifo_wr_en util_adc_pack2.if_packed_fifo_wr_en conduit
add_connection axi_adc_dma2.if_fifo_wr_overflow util_adc_pack2.if_packed_fifo_wr_overflow conduit
add_connection axi_adc_dma2.if_fifo_wr_sync util_adc_pack2.if_packed_fifo_wr_sync conduit
add_connection axi_adc_dma.if_fifo_wr_overflow util_adc_pack.if_packed_fifo_wr_overflow conduit
add_connection axi_adrv9001.adc_1_ch_0 util_adc_wfifo.din_0 conduit
add_connection axi_adrv9001.adc_1_ch_1 util_adc_wfifo.din_1 conduit
add_connection axi_adrv9001.adc_1_ch_2 util_adc_wfifo.din_2 conduit
add_connection axi_adrv9001.adc_1_ch_3 util_adc_wfifo.din_3 conduit
add_connection axi_adrv9001.adc_2_ch_0 util_adc_wfifo2.din_0 conduit
add_connection rom_sys_0.if_rom_addr axi_sysid_0.if_rom_addr conduit
add_connection rom_sys_0.if_rom_data axi_sysid_0.if_sys_rom_data conduit
add_connection util_adc_pack2.adc_ch_0 util_adc_wfifo2.dout_0 conduit
add_connection util_adc_pack2.adc_ch_1 util_adc_wfifo2.dout_1 conduit
add_connection util_adc_pack2.if_fifo_wr_overflow util_adc_wfifo2.if_dout_ovf conduit
add_connection util_adc_pack.if_fifo_wr_overflow util_adc_wfifo.if_dout_ovf conduit
add_connection util_adc_pack.if_packed_fifo_wr_data axi_adc_dma.if_fifo_wr_din conduit
add_connection util_adc_pack.if_packed_fifo_wr_en axi_adc_dma.if_fifo_wr_en conduit
add_connection util_adc_pack.if_packed_fifo_wr_sync axi_adc_dma.if_fifo_wr_sync conduit
add_connection util_adc_wfifo2.din_1 axi_adrv9001.adc_2_ch_1 conduit
add_connection util_adc_wfifo2.if_din_ovf axi_adrv9001.if_adc_2_dovf conduit
add_connection util_adc_wfifo.dout_0 util_adc_pack.adc_ch_0 conduit
add_connection util_adc_wfifo.dout_1 util_adc_pack.adc_ch_1 conduit
add_connection util_adc_wfifo.dout_2 util_adc_pack.adc_ch_2 conduit
add_connection util_adc_wfifo.dout_3 util_adc_pack.adc_ch_3 conduit
add_connection util_adc_wfifo.if_din_ovf axi_adrv9001.if_adc_1_dovf conduit
add_connection util_dac_rfifo2.dout_0 axi_adrv9001.dac_2_ch_0 conduit
add_connection util_dac_rfifo2.dout_1 axi_adrv9001.dac_2_ch_1 conduit
add_connection util_dac_rfifo2.if_dout_unf axi_adrv9001.if_dac_2_dunf conduit
add_connection util_dac_rfifo.dout_0 axi_adrv9001.dac_1_ch_0 conduit
add_connection util_dac_rfifo.dout_1 axi_adrv9001.dac_1_ch_1 conduit
add_connection util_dac_rfifo.dout_2 axi_adrv9001.dac_1_ch_2 conduit
add_connection util_dac_rfifo.dout_3 axi_adrv9001.dac_1_ch_3 conduit
add_connection util_dac_rfifo.if_dout_unf axi_adrv9001.if_dac_1_dunf conduit
add_connection util_dac_upack2.dac_ch_0 util_dac_rfifo2.din_0 conduit
add_connection util_dac_upack2.dac_ch_1 util_dac_rfifo2.din_1 conduit
add_connection util_dac_upack2.if_fifo_rd_underflow util_dac_rfifo2.if_din_unf conduit
add_connection util_dac_upack.dac_ch_0 util_dac_rfifo.din_0 conduit
add_connection util_dac_upack.dac_ch_1 util_dac_rfifo.din_1 conduit
add_connection util_dac_upack.dac_ch_2 util_dac_rfifo.din_2 conduit
add_connection util_dac_upack.dac_ch_3 util_dac_rfifo.din_3 conduit
add_connection util_dac_upack.if_fifo_rd_underflow util_dac_rfifo.if_din_unf conduit
add_connection hps_0.f2h_irq0 avl_adrv9001_gpio.irq interrupt
set_connection_parameter_value hps_0.f2h_irq0/avl_adrv9001_gpio.irq irqNumber 7
add_connection hps_0.f2h_irq0 axi_adc_dma2.interrupt_sender interrupt
set_connection_parameter_value hps_0.f2h_irq0/axi_adc_dma2.interrupt_sender irqNumber 1
add_connection hps_0.f2h_irq0 axi_adc_dma.interrupt_sender interrupt
set_connection_parameter_value hps_0.f2h_irq0/axi_adc_dma.interrupt_sender irqNumber 0
add_connection hps_0.f2h_irq0 axi_dac_dma2.interrupt_sender interrupt
set_connection_parameter_value hps_0.f2h_irq0/axi_dac_dma2.interrupt_sender irqNumber 3
add_connection hps_0.f2h_irq0 axi_dac_dma.interrupt_sender interrupt
set_connection_parameter_value hps_0.f2h_irq0/axi_dac_dma.interrupt_sender irqNumber 2
add_connection hps_0.f2h_irq0 axi_i2s_rx_dma.interrupt_sender interrupt
set_connection_parameter_value hps_0.f2h_irq0/axi_i2s_rx_dma.interrupt_sender irqNumber 5
add_connection hps_0.f2h_irq0 axi_i2s_tx_dma.interrupt_sender interrupt
set_connection_parameter_value hps_0.f2h_irq0/axi_i2s_tx_dma.interrupt_sender irqNumber 4
add_connection hps_0.f2h_irq0 sys_gpio_bd.irq interrupt
set_connection_parameter_value hps_0.f2h_irq0/sys_gpio_bd.irq irqNumber 8
add_connection hps_0.f2h_irq0 sys_gpio_in.irq interrupt
set_connection_parameter_value hps_0.f2h_irq0/sys_gpio_in.irq irqNumber 9
add_connection hps_0.f2h_irq0 sys_spi.irq interrupt
set_connection_parameter_value hps_0.f2h_irq0/sys_spi.irq irqNumber 6

# exported interfaces
add_interface adrv9001_gpio conduit end
set_interface_property adrv9001_gpio EXPORT_OF avl_adrv9001_gpio.external_connection
add_interface adrv9001_if conduit end
set_interface_property adrv9001_if EXPORT_OF axi_adrv9001.device_if
add_interface adrv9001_tdd_if conduit end
set_interface_property adrv9001_tdd_if EXPORT_OF axi_adrv9001.tdd_if
add_interface clk_50mhz clock source
set_interface_property clk_50mhz EXPORT_OF hps_0.h2f_user1_clock
add_interface i2s conduit end
set_interface_property i2s EXPORT_OF axi_i2s_adi.i2s
add_interface i2s_clk clock sink
set_interface_property i2s_clk EXPORT_OF axi_i2s_adi.if_data_clk_i
add_interface pr_rom_data_nc conduit end
set_interface_property pr_rom_data_nc EXPORT_OF axi_sysid_0.if_pr_rom_data
add_interface sys_clk clock sink
set_interface_property sys_clk EXPORT_OF sys_clk.clk_in
add_interface sys_gpio_bd conduit end
set_interface_property sys_gpio_bd EXPORT_OF sys_gpio_bd.external_connection
add_interface sys_gpio_in conduit end
set_interface_property sys_gpio_in EXPORT_OF sys_gpio_in.external_connection
add_interface sys_gpio_out conduit end
set_interface_property sys_gpio_out EXPORT_OF sys_gpio_out.external_connection
add_interface sys_hps_h2f_reset reset source
set_interface_property sys_hps_h2f_reset EXPORT_OF hps_0.h2f_reset
add_interface sys_hps_hps_io conduit end
set_interface_property sys_hps_hps_io EXPORT_OF hps_0.hps_io
add_interface sys_hps_i2c0 conduit end
set_interface_property sys_hps_i2c0 EXPORT_OF hps_0.i2c0
add_interface sys_hps_i2c0_clk clock source
set_interface_property sys_hps_i2c0_clk EXPORT_OF hps_0.i2c0_clk
add_interface sys_hps_i2c0_scl_in clock sink
set_interface_property sys_hps_i2c0_scl_in EXPORT_OF hps_0.i2c0_scl_in
add_interface sys_hps_memory conduit end
set_interface_property sys_hps_memory EXPORT_OF hps_0.memory
add_interface sys_rstn reset sink
set_interface_property sys_rstn EXPORT_OF sys_clk.clk_in_reset
add_interface sys_spi conduit end
set_interface_property sys_spi EXPORT_OF sys_spi.external

set_interconnect_requirement {$system} qsys_mm.burstAdapterImplementation PER_BURST_TYPE_CONVERTER
set_interconnect_requirement {$system} qsys_mm.clockCrossingAdapter AUTO
set_interconnect_requirement {$system} qsys_mm.maxAdditionalLatency 4

save_system system_bd.qsys
